# EAGLE design robot_controller (EAGLE 6.4)
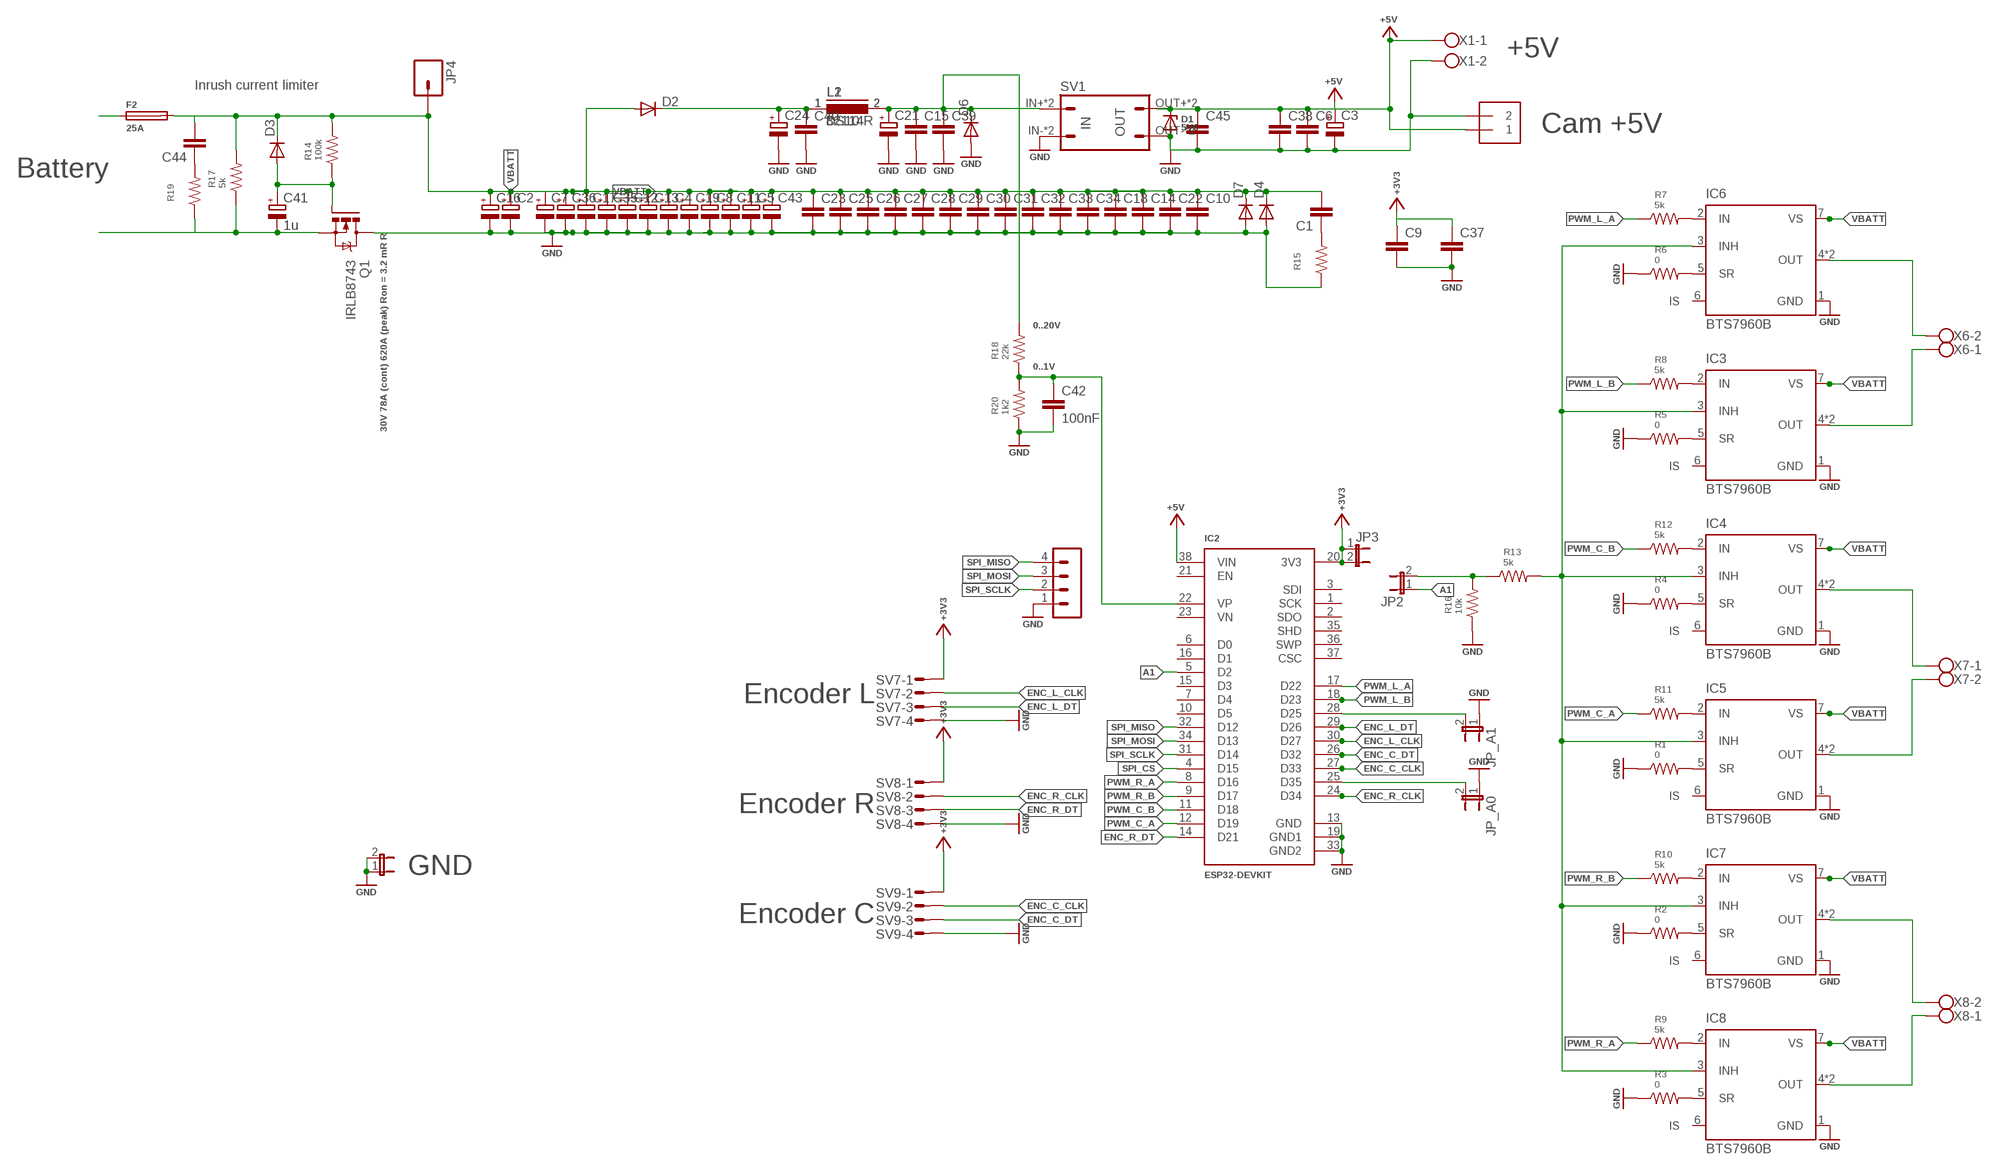
[diagram p0: schematic, sheet 1]

## Parts
C1  C-EU025-025X050  [C025-025X050]
C2  CPOL-EUE5-10.5  [E5-10,5]
C3  CPOL-EUE5-10.5  [E5-10,5]
C4  CPOL-EUE5-10.5  [E5-10,5]
C5  CPOL-EUE5-10.5  [E5-10,5]
C6  C-EUC1206  [C1206]
C7  CPOL-EUE5-10.5  [E5-10,5]
C8  CPOL-EUE5-10.5  [E5-10,5]
C9  C-EUC1206  [C1206]
C10  C-EUC1206  [C1206]
C11  CPOL-EUE5-10.5  [E5-10,5]
C12  CPOL-EUE5-10.5  [E5-10,5]
C13  CPOL-EUE5-10.5  [E5-10,5]
C14  C-EUC1206  [C1206]
C15  C-EUC1206  [C1206]
C16  CPOL-EUE5-10.5  [E5-10,5]
C17  CPOL-EUE5-10.5  [E5-10,5]
C18  C-EUC1206  [C1206]
C19  CPOL-EUE5-10.5  [E5-10,5]
C21  CPOL-EUE5-10.5  [E5-10,5]
C22  C-EUC1206  [C1206]
C23  C-EUC1206  [C1206]
C24  CPOL-EUE5-10.5  [E5-10,5]
C25  C-EUC1206  [C1206]
C26  C-EUC1206  [C1206]
C27  C-EUC1206  [C1206]
C28  C-EUC1206  [C1206]
C29  C-EUC1206  [C1206]
C30  C-EUC1206  [C1206]
C31  C-EUC1206  [C1206]
C32  C-EUC1206  [C1206]
C33  C-EUC1206  [C1206]
C34  C-EUC1206  [C1206]
C35  CPOL-EUE5-10.5  [E5-10,5]
C36  CPOL-EUE5-10.5  [E5-10,5]
C37  C-EUC1206  [C1206]
C38  C-EUC1206  [C1206]
C39  C-EUC1206  [C1206]
C40  C-EUC1206  [C1206]
C41  1u  CPOL-EUE2.5-6  [E2,5-6]
C42  100nF  C-EUC1206  [C1206]
C43  CPOL-EUE5-10.5  [E5-10,5]
C44  C-EU050-030X075  [C050-030X075]
C45  C-EUC1206  [C1206]
D1  5V6  ZENER-DIODEDO41Z10  [DO41Z10]
D2  DIODE-DO15-12  [DO15-12]
D3  DIODE-DO-214AC  [DO-214AC]
D4  DIODE-DO41-7.6  [DO41-7.6]
D6  DIODE-DO15-12  [DO15-12]
D7  DIODE-DO41-7.6  [DO41-7.6]
F2  25A  19559  [SHK20L]
IC2  ESP32-DEVKIT  ESP32-DEVKIT-V1NOHOLES  [DEVKIT-V1-NOHOLES]
IC3  BTS7960B  TLE5205-2G  [P-TO263-7-1]
IC4  BTS7960B  TLE5205-2G  [P-TO263-7-1]
IC5  BTS7960B  TLE5205-2G  [P-TO263-7-1]
IC6  BTS7960B  TLE5205-2G  [P-TO263-7-1]
IC7  BTS7960B  TLE5205-2G  [P-TO263-7-1]
IC8  BTS7960B  TLE5205-2G  [P-TO263-7-1]
J6  1X2-3.5MM  [3.5MMTERM]
JP1  JP1E  [JP1]
JP2  JP1E  [JP1]
JP3  JP1E  [JP1]
JP4  M01PTH_LONGPAD  [1X01_LONGPAD]
JP_A0  JP1E  [JP1]
JP_A1  JP1E  [JP1]
L1  82114R  [82114R]
L2  DS10  [DS10]
Q1  IRLB8743  IRF540  [TO220BV]
R1  0  R-US_R1206  [R1206]
R2  0  R-US_R1206  [R1206]
R3  0  R-US_R1206  [R1206]
R4  0  R-US_R1206  [R1206]
R5  0  R-US_R1206  [R1206]
R6  0  R-US_R1206  [R1206]
R7  5k  R-US_R1206  [R1206]
R8  5k  R-US_R1206  [R1206]
R9  5k  R-US_R1206  [R1206]
R10  5k  R-US_R1206  [R1206]
R11  5k  R-US_R1206  [R1206]
R12  5k  R-US_R1206  [R1206]
R13  5k  R-US_R1206  [R1206]
R14  100k  R-US_R1206  [R1206]
R15  R-US_0411/3V  [0411V]
R16  10k  R-US_R1206  [R1206]
R17  5k  R-US_R1206  [R1206]
R18  22k  R-US_R1206  [R1206]
R19  R-US_0617/5V  [0617V]
R20  1k2  R-US_R1206  [R1206]
SV1  MA04-1SMALL  [MA04-2]
SV6  MA04-1  [MA04-1]
SV7  MT6-4  [MT6-4]
SV8  MT6-4  [MT6-4]
SV9  MT6-4  [MT6-4]
X1  W239-302  [W239-302]
X6  W239-302  [W239-302]
X7  W239-302  [W239-302]
X8  W239-302  [W239-302]

## Nets
+3V3: C9.1 C37.1 IC2.20(3V3) JP3.1 JP3.2 SV7.1 SV8.1 SV9.1
+5V: C3.+ C6.1 C38.1 C45.1 D1.C IC2.38(VIN) J6.1 SV1.OUT+ SV1.OUT+1(OUT+) X1.1
A1: IC2.5(D2) JP2.1
ENC_C_CLK: IC2.27(D33) SV9.2
ENC_C_DT: IC2.26(D32) SV9.3
ENC_L_CLK: IC2.30(D27) SV7.2
ENC_L_DT: IC2.29(D26) SV7.3
ENC_R_CLK: IC2.24(D34) SV8.2
ENC_R_DT: IC2.14(D21) SV8.3
GND: C2.- C3.- C4.- C5.- C6.2 C7.- C8.- C9.2 C10.2 C11.- C12.- C13.- C14.2 C15.2 C16.- C17.- C18.2 C19.- C21.- C22.2 C23.2 C24.- C25.2 C26.2 C27.2 C28.2 C29.2 C30.2 C31.2 C32.2 C33.2 C34.2 C35.- C36.- C37.2 C38.2 C39.2 C40.2 C42.2 C43.- C45.2 D1.A D4.A D6.A D7.A IC2.13(GND) IC2.19(GND1) IC2.33(GND2) IC3.1(GND) IC4.1(GND) IC5.1(GND) IC6.1(GND) IC7.1(GND) IC8.1(GND) J6.2 JP1.1 JP1.2 JP_A0.1 JP_A1.1 Q1.D R1.1 R2.1 R3.1 R4.1 R5.1 R6.1 R15.1 R16.1 R20.1 SV1.IN- SV1.IN-1(IN-) SV1.OUT- SV1.OUT-1(OUT-) SV6.1 SV7.4 SV8.4 SV9.4 X1.2
N$1: C24.+ C40.1 D2.C L1.1 L2.1
N$2: IC7.4(OUT) IC7.8(OUT) X8.2
N$3: IC7.5(SR) R2.2
N$4: IC8.4(OUT) IC8.8(OUT) X8.1
N$5: IC5.4(OUT) IC5.8(OUT) X7.2
N$6: IC4.4(OUT) IC4.8(OUT) X7.1
N$7: F2.1A F2.1B
N$8: IC2.28(D25) JP_A1.2
N$9: IC3.4(OUT) IC3.8(OUT) X6.1
N$10: IC6.4(OUT) IC6.8(OUT) X6.2
N$11: IC5.5(SR) R1.2
N$13: IC8.5(SR) R3.2
N$14: IC4.5(SR) R4.2
N$15: C15.1 C21.+ C39.1 D6.C L1.2 L2.2 R18.2 SV1.IN+ SV1.IN+1(IN+)
N$16: IC3.5(SR) R5.2
N$17: IC6.5(SR) R6.2
N$18: IC3.3(INH) IC4.3(INH) IC5.3(INH) IC6.3(INH) IC7.3(INH) IC8.3(INH) R13.2
N$20: IC6.2(IN) R7.2
N$21: IC4.2(IN) R12.2
N$22: IC5.2(IN) R11.2
N$23: IC7.2(IN) R10.2
N$24: IC8.2(IN) R9.2
N$25: IC3.2(IN) R8.2
N$26: C1.1 R15.2
N$27: JP2.2 R13.1 R16.2
N$29: IC2.25(D35) JP_A0.2
N$76: C41.+ D3.A Q1.G R14.1
N$78: C41.- Q1.S R17.1 R19.1
N$79: C42.1 IC2.22(VP) R18.1 R20.2
N$80: C44.1 R19.2
PWM_C_A: IC2.12(D19) R11.1
PWM_C_B: IC2.11(D18) R12.1
PWM_L_A: IC2.17(D22) R7.1
PWM_L_B: IC2.18(D23) R8.1
PWM_R_A: IC2.8(D16) R9.1
PWM_R_B: IC2.9(D17) R10.1
SPI_CS: IC2.4(D15)
SPI_MISO: IC2.32(D12) SV6.4
SPI_MOSI: IC2.34(D13) SV6.3
SPI_SCLK: IC2.31(D14) SV6.2
VBATT: C1.2 C2.+ C4.+ C5.+ C7.+ C8.+ C10.1 C11.+ C12.+ C13.+ C14.1 C16.+ C17.+ C18.1 C19.+ C22.1 C23.1 C25.1 C26.1 C27.1 C28.1 C29.1 C30.1 C31.1 C32.1 C33.1 C34.1 C35.+ C36.+ C43.+ C44.2 D2.A D3.C D4.C D7.C F2.2A F2.2B IC3.7(VS) IC4.7(VS) IC5.7(VS) IC6.7(VS) IC7.7(VS) IC8.7(VS) JP4.1 R14.2 R17.2
Unconnected: IC2.1(SCK) IC2.2(SDO) IC2.3(SDI) IC2.6(D0) IC2.7(D4) IC2.10(D5) IC2.15(D3) IC2.16(D1) IC2.21(EN) IC2.23(VN) IC2.35(SHD) IC2.36(SWP) IC2.37(CSC) IC3.6(IS) IC4.6(IS) IC5.6(IS) IC6.6(IS) IC7.6(IS) IC8.6(IS)

## Notes on the sheet
- +5V
- Inrush current limiter
- Cam +5V
- Battery
- 0..20V
- 0..1V
- 30V 78A (cont) 620A (peak) Ron = 3.2 mR R
- Encoder L
- Encoder R
- GND
- Encoder C

## Library data of the parts
C1 C6 C9 C10 C14 C15 C18 C22 C23 C25-C34 C37-C40 C42 C44 C45 = rcl:C-EU: CAPACITOR, European symbol
C2-C5 C7 C8 C11-C13 C16 C17 C19 C21 C24 C35 C36 C41 C43 = rcl:CPOL-EU: POLARIZED CAPACITOR, European symbol
D1 = diode:ZENER-DIODE: Z-Diode
D2 D6 = diode:DIODE-: DIODE
D3 D4 D7 = diode_smd:DIODE-: DIODE
F2 = car_fuse:19559: FUSE HOLDER TR5, Wickmann
IC2 = ESP32-DEVKIT-V1:ESP32-DEVKIT-V1: Dual core, Wi-Fi: 2.4 GHz up to 150 Mbits/s,BLE (Bluetooth Low Energy) and legacy Bluetooth, 32 bits, Up to 240 MHz Check prices <https://pricing.snapeda.com/parts/ESP32-DEVKIT-V1/Do%20it/view-part?ref=eda>
IC3-IC8 = untitled:TLE5205-2: 5-A H-Bridge for DC-Motor Applications Source: http://www.infineon.com .. tle5205-2.pdf; OC_FARNELL: unknown; OC_NEWARK: unknown
J6 = adafruit:1X2: 3.5mm Terminal block http://www.ladyada.net/library/pcb/eaglelibrary.html
JP1-JP3 JP_A0 JP_A1 = jumper:JP1E: JUMPER
JP4 = SparkFun:M01: Header 1 Standard 1-pin 0.1" header. Use with straight break away headers (SKU : PRT-00116), right angle break away headers (PRT-00553), swiss pins (PRT-00743), machine pins (PRT-00117), and female headers (PRT-00115).
L1 = inductors:82114R: INDUCTOR
L2 = inductors:DS10: INDUCTOR
Q1 = transistor-power:IRF540: HEXFET Power MOSFET
R1-R20 = rcl:R-US_: RESISTOR, American symbol
SV1 = voltage_converter:MA04-1: PIN HEADER
SV6 = con-lstb:MA04-1: PIN HEADER; OC_FARNELL: unknown; OC_NEWARK: unknown
SV7-SV9 = con-amp-mt:MT6-4: AMP MT6 CONNECTOR; OC_FARNELL: unknown; OC_NEWARK: unknown
X1 X6-X8 = voltage_converter:W239-302: WAGO SCREW CLAMP; OC_FARNELL: unknown; OC_NEWARK: unknown

## Board
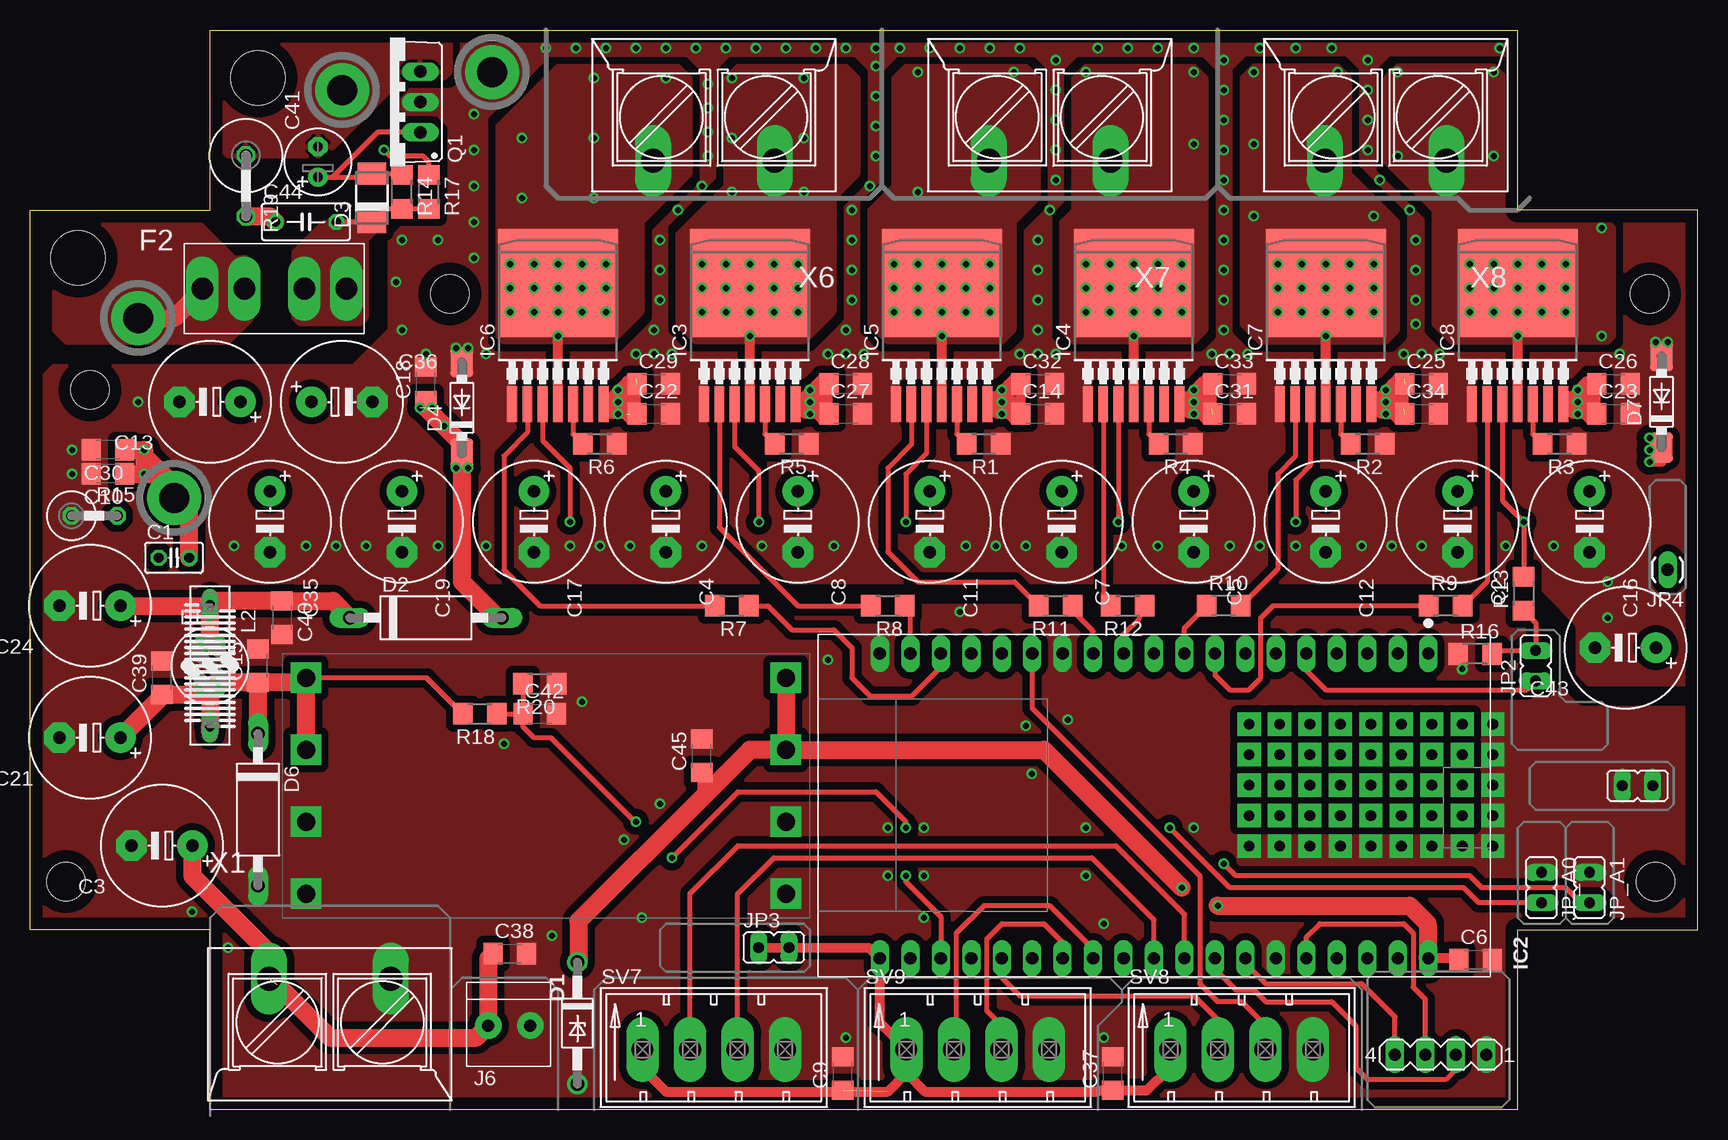
[diagram p1: board, top side]
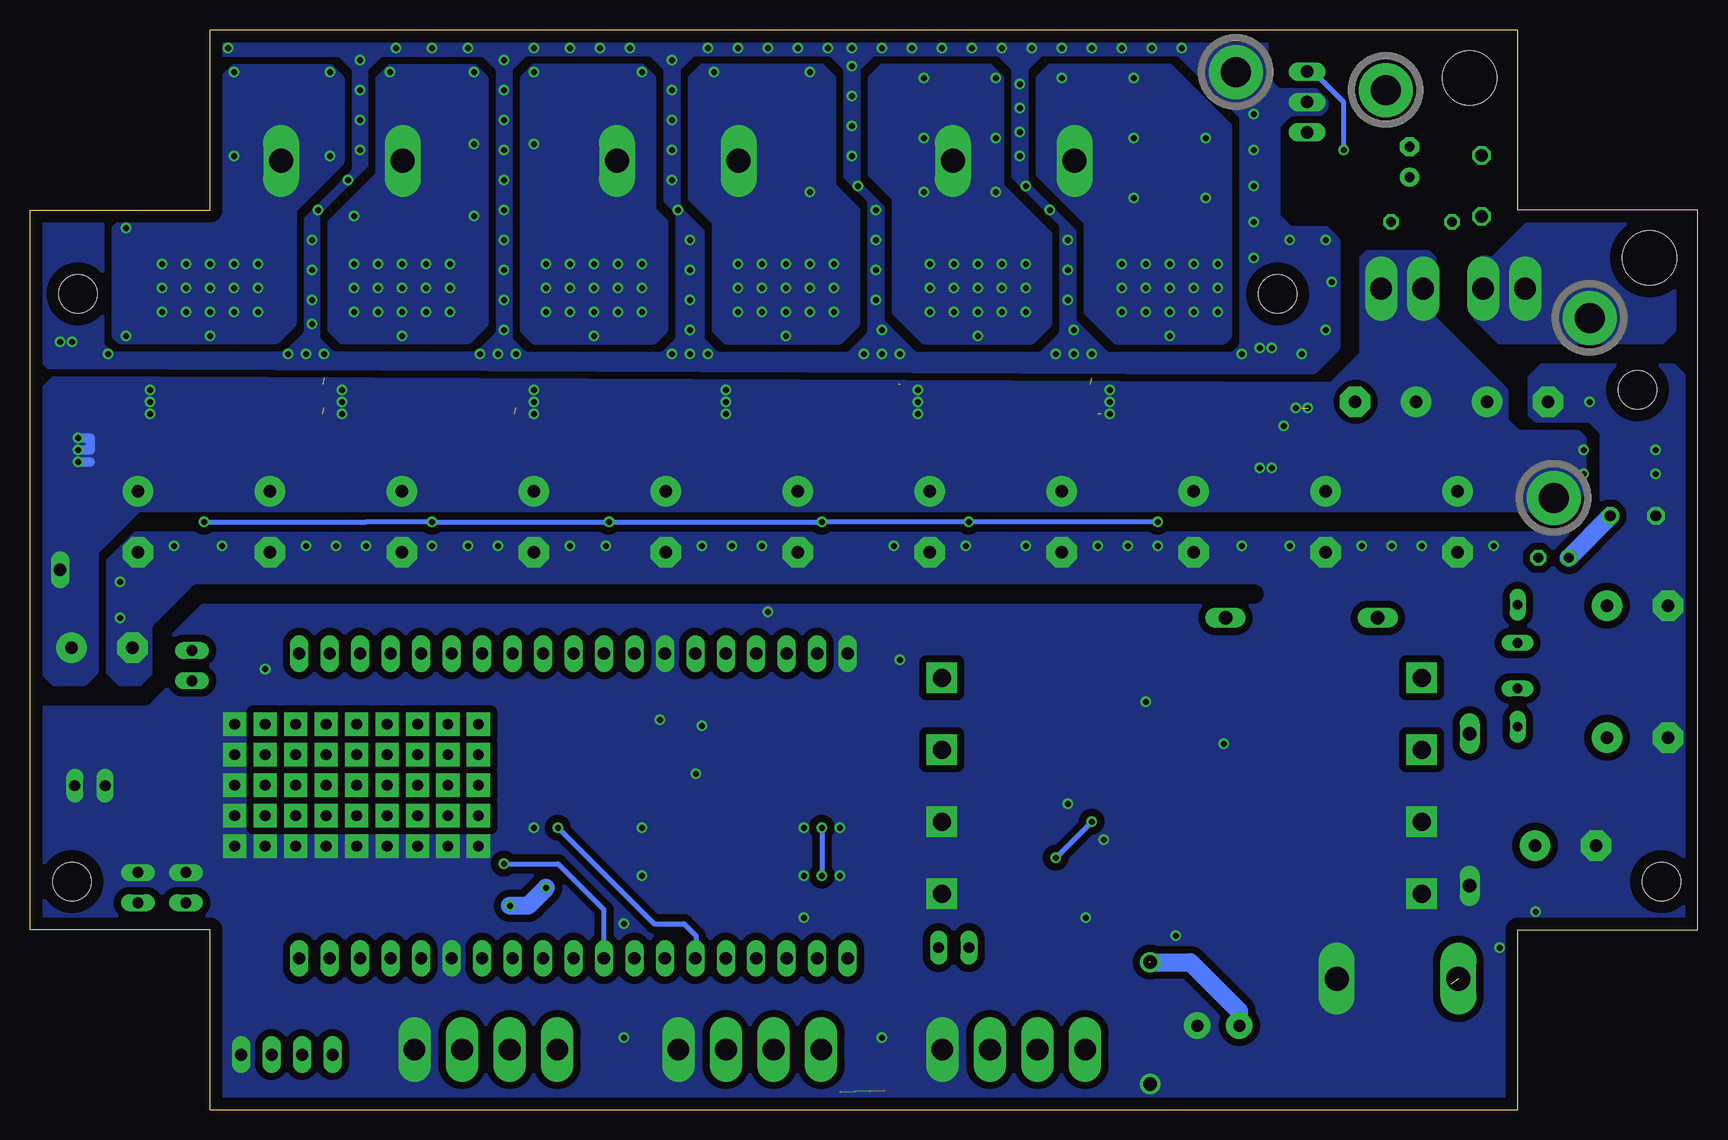
[diagram p2: board, bottom side, seen from below]

Size 139 x 90 mm. Coordinates in mm from the lower left corner, seen from the top.
Outline: 124,0 15,0 15,15 0,15 0,75 15,75 15,90 124,90 124,75 139,75 139,15 124,15 124,0
Copper layers (1*16): Top 0.035mm / dielectric 1.5mm / Bottom 0.035mm
Design rules "default *": minimum track width 10mil, minimum drill 24mil, track to track 8mil, track to pad 8mil, pad to pad 8mil, via to via 8mil, smd to smd 8mil, copper to edge 40mil, drill to drill 8mil, minimum pad ring 10mil, minimum via ring 8mil, stop-mask expansion 4mil, vias tented up to drill 0mil, thermal gap 10mil
Holes 3.2 mm at 5,60 3,19 135.5,19 135,68 35,68
Holes 4.5 mm at 4,71 19,86
tRestrict: 6 lines
bRestrict: area 26.7,57.2 to 30.3,60.8; 5 lines

### Footprints (pad centres in the part's own frame; a part is rotated, then mirrored left to right if it is on the bottom)
C025-025X050 = drill 0.813 octagon: 1 -1.27,0; 2 1.27,0
E5-10,5 = drill 1.016 pad 2.54: + -2.54,0 | drill 1.016 pad 2.54 octagon: - 2.54,0
C1206 = smd 1.6 x 1.8: 1 -1.4,0; 2 1.4,0
E2,5-6 = drill 0.813 pad 1.6: + -1.27,0 | drill 0.813 pad 1.6 octagon: - 1.27,0
C050-030X075 = drill 0.813 octagon: 1 -2.54,0; 2 2.54,0
DO41Z10 = drill 1.118: A 5.08,0; C -5.08,0
DO15-12 = drill 1.118 long: A 6.35,0; C -6.35,0
DO-214AC = smd 1.8 x 2.4: A 2.025,0; C -2.025,0
DO41-7.6 = smd 2.54 x 1.905: A 3.81,0; C -3.81,0
SHK20L = drill 1.8 pad 2.54 long: 1A 1.5,0; 1B 5,0; 2A 10,0; 2B 13.5,0
DEVKIT-V1-NOHOLES = drill 1.016 pad 1.422 long: 1 12.7,-19.05; 2 12.7,-16.51; 3 12.7,-13.97; 4 12.7,-11.43; 5 12.7,-8.89; 6 12.7,-6.35; 7 12.7,-3.81; 8 12.7,-1.27; 9 12.7,1.27; 10 12.7,3.81; 11 12.7,6.35; 12 12.7,8.89; 13 12.7,11.43; 14 12.7,13.97; 15 12.7,16.51; 16 12.7,19.05; 17 12.7,21.59; 18 12.7,24.13; 19 12.7,26.67; 20 -12.7,26.67; 21 -12.7,24.13; 22 -12.7,21.59; 23 -12.7,19.05; 24 -12.7,16.51; 25 -12.7,13.97; 26 -12.7,11.43; 27 -12.7,8.89; 28 -12.7,6.35; 29 -12.7,3.81; 30 -12.7,1.27; 31 -12.7,-1.27; 32 -12.7,-3.81; 33 -12.7,-6.35; 34 -12.7,-8.89; 35 -12.7,-11.43; 36 -12.7,-13.97; 37 -12.7,-16.51; 38 -12.7,-19.05
P-TO263-7-1 = smd 0.8 x 3: 1 -3.81,-9.207; 2 -2.54,-9.207; 3 -1.27,-9.207; 4 0,-9.207; 5 1.27,-9.207; 6 2.54,-9.207; 7 3.81,-9.207 | smd 10 x 9: 8 0,0.895
3.5MMTERM = drill 1 pad 2.184: 1 1.8,0; 2 -1.7,0
JP1 = drill 0.914 long: 1 0,-1.27; 2 0,1.27
1X01_LONGPAD = drill 1.016 long: 1 0,0
82114R = drill 0.813 long: 1 0,1.905; 2 0,-1.905
DS10 = drill 0.813 long: 1 -5.08,0; 2 5.08,0
TO220BV = drill 1.016 long: D 0,-2.54; G -2.54,-2.54; S 2.54,-2.54
R1206 = smd 1.6 x 1.803: 1 -1.422,0; 2 1.422,0
0411V = drill 0.914 octagon: 1 -2.54,0; 2 1.27,0
0617V = drill 1.016 octagon: 1 -2.54,0; 2 2.54,0
MA04-2 = drill 1.5 pad 2.54 square: IN+ -3,-20; IN+1 -9,-20; IN- 3,-20; IN-1 9,-20; OUT+ -3,20; OUT+1 -9,20; OUT- 3,20; OUT-1 9,20
MA04-1 = drill 1.016 long: 1 -3.81,0; 2 -1.27,0; 3 1.27,0; 4 3.81,0
MT6-4 = drill 1.803 long: 1 -5.944,0; 2 -1.981,0; 3 1.981,0; 4 5.944,0
W239-302 = drill 2 long: 1 -5.08,1.905; 2 5.08,1.905

### Placement (x,y rotation side)
C1  12,46 0 top
C2  119,49 270 top
C3  11,22 180 top
C4  53,49 270 top
C5  97,49 270 top
C6  120.5,12.5 0 top
C7  86,49 270 top
C8  64,49 270 top
C9  67.75,3 90 top
C10  6.5,53 180 top
C11  75,49 270 top
C12  108,49 270 top
C13  15,59 180 top
C14  84,58 0 top
C15  19,37 90 top
C16  130,49 270 top
C17  42,49 270 top
C18  33,60.5 90 top
C19  31,49 270 top
C21  5,31 180 top
C22  52,58 0 top
C23  132,58 0 top
C24  5,42 180 top
C25  116,60.5 0 top
C26  132,60.5 0 top
C27  68,58 0 top
C28  68,60.5 0 top
C29  52,60.5 0 top
C30  6.5,55 180 top
C31  100,58 0 top
C32  84,60.5 0 top
C33  100,60.5 0 top
C34  116,58 0 top
C35  20,49 270 top
C36  26,59 0 top
C37  90.25,3 90 top
C38  40,13 0 top
C39  11,36 90 top
C40  21,41 270 top
C41  24,79 90 top
C42  42.5,33 0 top
C43  133,38.5 180 top
C44  23,74 0 top
C45  56,29.5 90 top
D1  45.62,7.2 270 top
D2  33,41 0 top
D3  28.5,76 90 top
D4  36,58.5 90 top
D6  19,25 270 top
D7  136,59 90 top
F2  12.87,68.44 0 top
IC2  97.51,25.31 90 top
IC3  60,68 0 top
IC4  92,68 0 top
IC5  76,68 0 top
IC6  44,68 0 top
IC7  108,68 0 top
IC8  124,68 0 top
J6  40,7 180 top
JP1  134,27 90 top
JP2  125.5,37 0 top
JP3  62,13.5 270 top
JP4  136.5,45 180 top
JP_A0  126,18.5 180 top
JP_A1  130,18.5 180 top
L1  15,37 0 top
L2  15,37 270 top
Q1  30,84 90 top
R1  79.5,55.5 180 top
R2  111.5,55.5 180 top
R3  127.5,55.5 180 top
R4  95.5,55.5 180 top
R5  63.5,55.5 180 top
R6  47.5,55.5 180 top
R7  58.5,42 180 top
R8  71.5,42 180 top
R9  118,42 0 top
R10  99.5,42 0 top
R11  85.5,42 180 top
R12  91.5,42 180 top
R13  124.5,43 90 top
R14  31,76.5 270 top
R15  6,49.5 0 top
R16  120.46,37.98 0 top
R17  33.25,76.5 270 top
R18  37.5,33 180 top
R19  18,77 270 top
R20  42.5,35.5 180 top
SV1  43,27 270 top
SV6  117.59,4.58 180 top
SV7  57,5 0 top
SV8  101,5 0 top
SV9  79,5 0 top
X1  25,9 0 top
X6  57,81 180 top
X7  85,81 180 top
X8  113,81 180 top

### Tracks (layer width: path | path; a pad name or v marks a point on that pad's centre or on a via)
+3V3  (1 unrouted)
  Top 0.8: JP3.1 JP3.2 69.95,13.5 IC2.20
  Top 0.813: IC2.20 70.84,7.22 SV9.1 73.06,3.06 | SV7.1 51,4.94 51,3.5 53,1.5 71.5,1.5 73.06,3.06 | 73.06,3.06 74.61,1.5 89,1.5 89.1,1.6 C37.1 93.1,1.6 95,3.5 95,4.94 SV8.1
+5V  (via drill 0.5 pad 0.41)  (2 unrouted)
  Top 0.813: C6.1 118.99,12.61 IC2.38 | C45.1 56,26.5 56.25,26.25
  Top 1.5: C3.+ 13.54,19.46 19.92,13.08 X1.1 | 20.56,10.44 25,6 37.2,6 J6.1 38.2,12.6 C38.1 | SV1.OUT+1 SV1.OUT+ | SV1.OUT+ 60,30 56.25,26.25 45.72,15.72 45.72,12.28 | SV1.OUT+ 84.5,30 v96,18.5 | v99,17 115,17 116.5,15.5 116.5,12.67 IC2.38
  Bottom 1.5: J6.1 38.2,8.2 42.28,12.28 D1.C | v96,18.5 97.5,17 v99,17
A1
  Top 0.406: IC2.5 106.4,36.6 108,35 124.77,35 JP2.1
ENC_C_CLK
  Top 0.406: IC2.27 88.62,13.38 85,17 79.5,17 77.2,14.7 77.2,7.18 77.02,7 SV9.2
ENC_C_DT
  Top 0.406: SV9.3 80.98,7.02 79.75,8.25 79.75,14.25 81,15.5 84.5,15.5 86.08,13.92 IC2.26
ENC_L_CLK
  Top 0.406: SV7.2 55.02,18.02 59,22 90.5,22 96.24,16.26 IC2.30
ENC_L_DT
  Top 0.406: SV7.3 58.98,17.98 62,21 88.5,21 93.7,15.8 IC2.29
ENC_R_CLK
  Top 0.406: IC2.24 81,11 82.5,9.5 97,9.5 99,7.5 99,5.02 SV8.2
ENC_R_DT
  Top 0.406: 102.98,6 102.98,7.02 101,9 99,9 97.5,10.5 97.5,19.5 83.54,33.46 IC2.14
  Top 0.61: SV8.3 102.98,6 103,6.02
GND  (via drill 0.5, 0.5 pad 0.41, 0.9 pad 1.93, 2.5 pad 4.5)
  other vias: 52,65 38,63 52,63 45,47 50,47 56,47 68,63 66.5,63 50.5,63 61,47 67,47 83,47 91,47 94,47 100,47 105.5,47 111,47 116,47 28,47 23,47 3.5,55 9,59 36.5,63.5 84,63 85.5,63 123,47 127,47 131.5,44 38,47 34,47 54,75 56,77 37,80 34,72.5 37,71 102.5,47 113.5,47 77.5,41.5 131.5,41 80.5,47 78,47 47.5,47 25.5,47 17,47 69.5,63 82.5,63 53.5,63 114.5,63 116,63 117.5,63 132.5,63 100,63 98.5,63 101.5,63 68,65 68.5,67.5 68.5,70 68.5,72.5 68.5,75 70,77 70.5,79.5 52.5,67.5 52.5,70 52.5,72.5 84,65 99.5,65 115.5,65.5 37,74 31,72.5 30.5,69 37,77 37,83 35.5,63.5 31,65 33,63 84,67.5 84,70 84,72.5 85,75 85.5,77.5 85.5,80 85.5,82.5 85.5,85 85.5,87.5 70.5,82 70.5,84.5 70.5,87 99.5,67.5 99.5,70 99.5,72.5 99.5,75 99.5,77.5 99.5,80 99.5,82.5 99.5,85 99.5,87.5 115.5,67.5 115.5,70 115.5,72.5 115,75 112.5,77.5 111.5,80 111.5,82.5 111.5,85 111.5,87.5 122.5,88.5 108.5,88.5 105.5,88.5 102.5,88.5 97,88.5 94,88.5 91.5,88.5 89,88.5 82.5,88.5 80,88.5 77.5,88.5 75,88.5 72.5,88.5 70.5,88.5 68,88.5 65.5,88.5 136.5,64 56.5,79.5 56.5,81.5 56.5,83.5 56.5,85.5 63,88.5 60.5,88.5 58,88.5 55.5,88.5 53,88.5 50.5,88.5 48,88.5 45.5,88.5 43,88.5 121.94,21.96 121.94,24.5 121.94,27.04 121.94,29.58 121.94,32.12 97,23.5 88,23.5 89.5,15.5 74.5,16 74.5,23.5 66.5,37.5 135.5,64 71.5,23.5 71.5,19.5 74.5,19.5 119.4,36.71 46,34 39.5,30.5 49.5,22.5 43.5,14.5 52.5,25.5 51,16 68,6 89.5,6 83.5,28 83,32 86.5,32.5 88,19.5 16.5,13.5 13.5,16.5 101.62,21.96 104.16,21.96 106.7,21.96 109.24,21.96 111.78,21.96 114.32,21.96 116.86,21.96 119.4,21.96 38.5,86.5 3.5,53
  pour Top (isolate 0.6, rank 4, no thermals): 37,90 139,90 139,0 0,0 1,61 2,62 27,62 30,65 30,72.5 31,73.5 34,73.5 35,74.5 35,82 34,83 31.5,83 31,83.5 31,84.5 31.5,85 35,85 36,86 36,89
  pour Bottom (isolate 0.61, rank 2, no thermals): 1,61 2,62 13,62 14,61 14,58 13.5,57.5 9,57.5 8,56.5 8,50.5 10.5,48 130.5,48 133,45.5 133,37 130.5,34.5 138,34.5 138,0 0,0
  pour Bottom (isolate 0.6, rank 5, no thermals): 30,63.5 32,61.5 137,61.5 138,62.5 138,90.5 37,90 36,89 36,86 35,85 31.5,85 31,84.5 31,83.5 31.5,83 34,83 35,82 35,74.5 34,73.5 31,73.5 30,72.5
N$1
  Top 1.5: L1.1 L2.1 | C24.+ 14.92,42 L2.1 | L2.1 15.32,42.4 C40.1 25.25,42.4 D2.C
N$2  (via drill 0.5 pad 0.9)
  Top 0.813: IC7.4 IC7.8
  other vias: 102,74.5 109,86.5 102,86.5 102,80.5 112,74.5 108,68.5 110,68.5 112,68.5 112,66.5 110,66.5 108,66.5 108,64.5 106,66.5 104,66.5 104,68.5 106,68.5 104,70.5 106,70.5 108,70.5 110,70.5 112,70.5
  pour Top (isolate 0.5, rank 3, no thermals): 101,65.5 102.5,64 113,64 114,65 114,74 110,78 110,86 109,87 102,87 101,86
  pour Bottom (isolate 0.5, rank 3, no thermals): 101,65.5 102.5,64 113,64 114,65 114,74 110,78 110,86 109,87 102,87 101,86
N$3
  Top 0.406: IC7.5 109.27,56.31 R2.2
N$4  (via drill 0.5 pad 0.9)
  Top 0.813: IC8.4 IC8.8
  other vias: 122,79.5 122,86.5 114,86.5 114,79.5 124,68.5 122,68.5 120,68.5 120,66.5 122,66.5 124,66.5 124,64.5 126,66.5 128,66.5 128,68.5 126,68.5 126,70.5 128,70.5 124,70.5 122,70.5 120,70.5 131,64.5 131,73.5
  pour Top (isolate 0.5, rank 3, no thermals): 131.5,64 132,64.5 132,73.5 130.5,75 124,75 123,76 123,86 122,87 114,87 113,86 113,79 117,75 117,65.5 118.5,64
  pour Bottom (isolate 0.5, rank 3, no thermals): 131.5,64 132,64.5 132,73.5 130.5,75 124,75 123,76 123,86 122,87 114,87 113,86 113,79 117,75 117,65.5 118.5,64
N$5  (via drill 0.5 pad 0.9)
  Top 0.813: IC5.4 IC5.8
  other vias: 78,68.5 74,68.5 72,68.5 80,68.5 72,70.5 76,68.5 74,70.5 76,70.5 78,70.5 80,70.5 80,66.5 78,66.5 76,66.5 74,66.5 72,66.5 76,64.5 74,76.5 74,86.5 82,86.5
  pour Top (isolate 0.5, no thermals): 81,64 71.5,64 70,65.5 70,75 72,77 72,86 73,87 83,87 84,86 84,76 82,74 82,65
  pour Bottom (isolate 0.5, rank 3, no thermals): 81,64 71.5,64 70,65.5 70,75 72,77 72,86 73,87 83,87 84,86 84,76 82,74 82,65
N$6  (via drill 0.5 pad 0.9)
  Top 0.813: IC4.4 IC4.8
  other vias: 92,70.5 90,70.5 88,70.5 94,70.5 96,70.5 92,68.5 88,86.5 97,86.5 97,80.5 88,68.5 90,68.5 94,68.5 96,68.5 96,66.5 94,66.5 92,66.5 90,66.5 88,66.5 92,64.5
  pour Top (isolate 0.5, rank 3, no thermals): 87,64 86,65 86,74 87,75 87,86 88,87 97,87 98,86 98,65 97,64
  pour Bottom (isolate 0.5, rank 3, no thermals): 87,64 86,65 86,74 87,75 87,86 88,87 97,87 98,86 98,65 97,64
N$7  (via drill 2.5 pad 4.5)
  Top 1.5: v9,66 12,66 14.5,68.5
  pour Bottom (no thermals): 3,64 16.5,64 18.5,66 18.5,70.5 18,71 17,71 14,74 3,74 2,73 2,65
  pour Top (no thermals): 3,64 16.5,64 18.5,66 18.5,70.5 18,71 17,71 14,74 3,74 2,73 2,65
N$8  (via drill 0.5)
  Top 0.406: JP_A1.2 129.27,17.23 128,18.5 121,18.5 120,19.5 100.5,19.5 v99.5,20.5
  Bottom 0.406: v99.5,20.5 95,20.5 91.16,16.66 IC2.28
N$9  (via drill 0.5 pad 0.9)
  Top 0.813: IC3.4 IC3.8
  other vias: 58.5,86 58.5,81 58.5,76.5 60,68.5 58,68.5 56,68.5 62,68.5 64,68.5 64,66.5 62,66.5 60,66.5 58,66.5 56,66.5 56,70.5 58,70.5 60,70.5 62,70.5 64,70.5 60,64.5 64.5,76.5 64.5,81 64.5,86
  pour Top (no thermals): 54,65.5 54,73 58,77 58,86 59,87 68,87 69,86 69,78 67,76 67,66.5 64.5,64 55.5,64
  pour Bottom (isolate 0.5, rank 4, no thermals): 54,65.5 54,73 58,77 58,86 59,87 68,87 69,86 69,78 67,76 67,66.5 64.5,64 55.5,64
N$10  (via drill 0.5 pad 0.9)
  Top 0.813: IC6.4 IC6.8
  other vias: 41,76 53,86 47,81 41,81 47,86 44,68.5 44,70.5 46,70.5 46,68.5 48,70.5 48,68.5 42,70.5 42,68.5 40,68.5 40,70.5 40,66.5 42,66.5 44,66.5 46,66.5 48,66.5 47,76 44,64.5
  pour Top (isolate 0.5, rank 3, no thermals): 39,64.5 39,82 44,87 54,87 55,86 55,78 51,74 51,66.5 48.5,64 39.5,64
  pour Bottom (isolate 0.5, rank 3, no thermals): 39,64.5 39,82 44,87 54,87 55,86 55,78 51,74 51,66.5 48.5,64 39.5,64
N$11
  Top 0.406: IC5.5 77.27,56.31 R1.2
N$13
  Top 0.406: IC8.5 125.27,56.31 R3.2
N$14
  Top 0.406: IC4.5 93.27,56.31 R4.2
N$15
  Top 0.406: R18.2 33.08,36 SV1.IN+1
  Top 1.5: SV1.IN+ SV1.IN+1 22.6,35.6 C15.1 | D6.C C15.1 | C21.+ 11,34.46 C39.1 14.5,34.6 L1.2 | L1.2 L2.2 | C15.1 15.5,35.6 L1.2
N$16
  Top 0.406: IC3.5 61.27,56.31 R5.2
N$17
  Top 0.406: IC6.5 45.27,56.31 R6.2
N$18  (via drill 0.5, 0.5 pad 0.41, 0.5 pad 0.9)
  Top 0.406: IC6.3 42.73,55.77 45,53.5 v45,49 | IC5.3 74.73,54.73 73,53 v73,49 | IC3.3 58.73,55.27 60.75,53.25 v60.75,49 | IC4.3 v90.73,49 | R13.2 v124.5,49 122.73,50.77 IC8.3 | IC7.3 106.73,53.73 105.5,52.5 v105.5,49
  Bottom 0.406: v45,49 v60.75,49 v73,49 | v90.73,49 v73,49 | v124.5,49 111,49 v105.5,49 v73,49
  Bottom 0.61: v90.73,49 arc90 90.71,49.02
N$20
  Top 0.406: IC6.2 41.46,56.46 39.5,54.5 39.5,45 42.5,42 R7.2
N$21
  Top 0.406: IC4.2 89.46,43.04 90,42.5 90,42.08
  Top 0.61: 90,42.08 R12.2
N$22
  Top 0.406: IC5.2 73.46,55.46 71.5,53.5 71.5,46.5 74,44 82.08,44 R11.2
N$23
  Top 0.406: IC7.2 105.46,54.46 104,53 104,45.08 R10.2
N$24
  Top 0.406: IC8.2 121.46,44.04 R9.2
N$25
  Top 0.406: IC3.2 57.46,48.54 64,42 R8.2
N$26
  Bottom 1.5: R15.2 7.27,49.46 C1.1
N$27
  Top 0.406: R16.2 122.17,38.27 JP2.2 125.5,40.58 R13.1
N$29  (via drill 0.5)
  Top 0.406: JP_A0.2 120.77,17.23 119.5,18.5 100,18.5 v95,23.5
  Bottom 0.406: v95,23.5 87,15.5 84.5,15.5 83.5,14.5 83.5,12.65 IC2.25
N$33  (via drill 0.9 pad 1.93)
  other vias: 111.78,24.5
N$34  (via drill 0.9 pad 1.93)
  other vias: 106.7,24.5
N$35  (via drill 0.9 pad 1.93)
  other vias: 109.24,24.5
N$37  (via drill 0.9 pad 1.93)
  other vias: 104.16,24.5
N$38  (via drill 0.9 pad 1.93)
  other vias: 101.62,24.5
N$41  (via drill 0.9 pad 1.93)
  other vias: 101.62,27.04
N$42  (via drill 0.9 pad 1.93)
  other vias: 104.16,27.04
N$44  (via drill 0.9 pad 1.93)
  other vias: 106.7,27.04
N$45  (via drill 0.9 pad 1.93)
  other vias: 109.24,27.04
N$46  (via drill 0.9 pad 1.93)
  other vias: 111.78,27.04
N$47  (via drill 0.9 pad 1.93)
  other vias: 111.78,29.58
N$48  (via drill 0.9 pad 1.93)
  other vias: 109.24,29.58
N$49  (via drill 0.9 pad 1.93)
  other vias: 106.7,29.58
N$51  (via drill 0.9 pad 1.93)
  other vias: 104.16,29.58
N$52  (via drill 0.9 pad 1.93)
  other vias: 101.62,29.58
N$55  (via drill 0.9 pad 1.93)
  other vias: 101.62,32.12
N$56  (via drill 0.9 pad 1.93)
  other vias: 104.16,32.12
N$58  (via drill 0.9 pad 1.93)
  other vias: 106.7,32.12
N$59  (via drill 0.9 pad 1.93)
  other vias: 109.24,32.12
N$60  (via drill 0.9 pad 1.93)
  other vias: 111.78,32.12
N$61  (via drill 0.9 pad 1.93)
  other vias: 114.32,32.12
N$62  (via drill 0.9 pad 1.93)
  other vias: 116.86,32.12
N$63  (via drill 0.9 pad 1.93)
  other vias: 119.4,32.12
N$64  (via drill 0.9 pad 1.93)
  other vias: 119.4,29.58
N$65  (via drill 0.9 pad 1.93)
  other vias: 116.86,29.58
N$66  (via drill 0.9 pad 1.93)
  other vias: 114.32,29.58
N$67  (via drill 0.9 pad 1.93)
  other vias: 114.32,27.04
N$68  (via drill 0.9 pad 1.93)
  other vias: 116.86,27.04
N$69  (via drill 0.9 pad 1.93)
  other vias: 119.4,27.04
N$70  (via drill 0.9 pad 1.93)
  other vias: 119.4,24.5
N$71  (via drill 0.9 pad 1.93)
  other vias: 116.86,24.5
N$72  (via drill 0.9 pad 1.93)
  other vias: 114.32,24.5
N$76
  Top 0.406: Q1.G 28.96,81.46 25.23,77.73 | C41.+ 25.23,77.73 | 25.23,77.73 28.21,77.73 D3.A 30.9,78.03 R14.1
N$78  (via drill 0.5, 2.5 pad 4.5)
  Top 0.406: R17.1 33.25,79 32.75,79.5 30,79.5 v29.5,80
  Bottom 0.406: v29.5,80 29.5,84 32,86.5 32.5,86.5 Q1.S
  other vias: 26,85
  pour Top: 15.5,89.5 34.5,89.5 35,89 35,86.5 34.5,86 31,86 24.5,79.5 16.5,79.5 15.5,80.5
N$79  (via drill 0.5, 0.5 pad 0.41)
  Top 0.406: R18.1 C42.1 | v50.5,24 50.42,24 43.42,31 42,31 41.1,31.9 C42.1 | v53.5,21 59,26.5 70.5,26.5 73,24 v73,23.5 | v73,19.5 73,19 75.92,16.08 IC2.22 | R20.2 41.1,35.48 C42.1
  Bottom 0.406: v50.5,24 v53.5,21 | v73,23.5 v73,19.5
N$80
  Top 1.5: R19.2 20,74.46 C44.1
PWM_C_A
  Top 0.406: IC2.12 88.62,39.88 87,41.5 | 87,41.92 R11.1
  Top 0.61: 87,41.5 87,41.92
PWM_C_B
  Top 0.406: IC2.11 91.16,39.66 92.5,41 92.5,41.58
  Top 0.61: 92.5,41.58 R12.1
PWM_L_A
  Top 0.406: R7.1 61.5,42 63.5,40 67,40 68.5,38.5 68.5,36 70,34.5 73.5,34.5 76,37 76,37.93 IC2.17
PWM_L_B
  Top 0.406: IC2.18 73.38,41.54 R8.1
PWM_R_A
  Top 0.406: R9.1 103.6,42 102.6,41 102.6,36 101.6,35 100,35 98.78,36.22 IC2.8
PWM_R_B
  Top 0.406: IC2.9 96.24,40.16 R10.1
SPI_MISO
  Top 0.406: IC2.32 101.32,12.18 103,10.5 111,10.5 113.78,7.72 SV6.4
SPI_MOSI
  Top 0.406: IC2.34 106.4,14.4 107.5,15.5 114.5,15.5 115.3,14.7 115.3,10.2 116.32,9.18 SV6.3
SPI_SCLK
  Top 0.406: SV6.2 118.86,3.36 118,2.5 111.5,2.5 110.5,3.5 110.5,7 108.5,9 103,9 102,10 100.5,10 98.78,11.72 IC2.31
VBATT  (via drill 0.5, 0.5 pad 0.9, 2.5 pad 4.5)  (7 unrouted)
  Top 0.406: R17.2 R14.2 29.6,75.08 D3.C 25.56,73.97 C44.2
  Top 0.8: 49.75,60.73 IC6.7 | v49,58 48.5,58.5 v49,59 | v49,59 v49,58 | v49,59 v49,60 | v49,58 48,58 | C27.1 66.5,58 | 66.5,58 66.23,58 | 66.23,58 66.23,60.5 | 66.23,60.5 65.5,60.5 v65,60 | v65,58 64.6,58 IC3.7 | v65,59 64,59 v65,60 | v65,59 64.5,58.5 | v65,58 v65,59 | v65,59 v65,60 | C14.1 82.6,60.4 82.5,60.5 81.5,60.5 v81,60 | v81,60 v81,59 | v81,59 v81,58 | v81,58 80.6,58 IC5.7 | v81,59 80.5,58.5 | v81,59 80.5,59 80,59.5 80.5,59.5 v81,60 | C33.1 98.5,60.5 | 98.5,61 98,61 97.5,60.5 97.73,60.5 97.73,60.73 v97,60 | v97,60 v97,59 | v97,59 v97,58 | v97,58 96.6,58 IC4.7 | v97,59 96.5,58.5 96.5,59.5 | v97,60 96.5,59.5 | 96.5,59.5 96,59.5 | v113,59 v113,60 112.5,59.5 112,59.5 | v113,59 v113,58 | v113,58 112.6,58 IC7.7 | C26.1 130.5,60.5 | 130.5,60.5 130.27,60.73 129.73,60.73 v129,60 | v129,60 v129,59 | v129,58 128.6,58 IC8.7 | v113,59 112,59 | v113,58 112.5,58.5 | v129,59 128,59 | v129,60 128.5,59.5 128,59.5 | v129,58 128.5,58.5 | C32.1 82.6,58.6 82,58 | 82,58 v81,58 | v81,59 82,58 | v81,59 82,59 v81,60 | v81,59 82,60 | C23.1 130.6,58.6 | 130.6,58.6 130,58 v129,58 | 130.6,58.6 129.6,58.6 v129,58 | v129,58 v129,59 | 130,59 v129,59 | v129,59 130,60 v129,60 | D7.C 135.81,55.19 v135,56 | v135,55 136,55 136,54 v135,54 | v65,58 66,58 | 66,58 66.23,58 | v65,59 66,58 | v65,58 66,59 | v65,59 66,59 | 66,59 v65,60 | 66.23,60.5 66.5,60.5 | 66.5,60.5 66.5,60 | 66.5,60 66.5,58 | 66.5,60 v65,60 | v49,58 50,58 | 50,58 50,59 | 50,59 v49,59 | v49,59 50,58 | v49,58 50,59 | 50,59 v49,60 | v49,59 50,60 | 50,60 v49,60 | v49,60 50,61 50.5,61 50.5,60 | 50.5,60 50.5,59 50,59 | 50,59 50,60 | 50,60 50.5,60 | v129,59 130.5,59 130.5,60.5 | 130.5,60.5 130,60.5 130,59.5 | v129,58 129.5,58 130,57.5 130.5,57.5 | v113,58 113.5,58 114,57.5 114.5,57.5 | v97,58 97.5,58 98,57.5 98.5,57.5
  Top 0.8: v81,58 81.5,58 82,57.5 82.5,57.5 | v81,60 82,61 82.5,61 82.5,59.5 | v65,60 66,61 66.5,61 66.5,60.5 | v65,58 65.5,58 66,57.5 66.5,57.5 | v49,58 49.5,58 50,57.5 50.5,57.5
  Top 0.813: IC6.7 47.81,58.19 | C22.1 49.75,58 49.75,60.73 | v97,58 98,58 98.5,58.5 98.5,60.5 | 98.5,61 98.5,60.5 | 98.5,60.5 98,60 98,58.5 97.5,58.5 97.5,60 | v113,58 114,58 114.5,58.5 114.5,61 114,61 113.5,60.5 | 113.5,60.5 v113,60 113.5,60 | 113.5,60 114,60 113.5,60.5 | 113.5,60 113.5,59.5 114,59 113.5,58.5
  Top 1.5: D2.A 39,41 36,44 D4.C 36,55.5 33,58.5 C18.1 | 19.96,51.5 C35.+ | C1.2 13.27,49.73 v12,51 12,52 11,53 | C30.1 v9.5,55 9.5,54.5 | C10.1 v9.5,53 | v9.5,53 11,53 | 9.5,54.5 v9.5,53 | 11,53 9.5,54.5
  Bottom 0.8: v135,56 134,56 134,55 v135,55 | v135,54 134,54
  Bottom 1.5: 19.54,51.54 C35.+
  other vias: 36.5,53.5 34.5,57 35.5,53.5 32.5,58.5 33.5,58.5
  pour Bottom (no thermals): 9.5,51.5 11,50 130,50 133.5,46.5 133.5,36.5 134.5,35.5 137,35.5 138,36.5 138,60 137,61 30.5,60.5 28,63 28,71 27.5,71.5 22.5,71.5 22,71 22,66 16,60 16,57.5 15,56.5 10,56.5 9.5,56
  pour Top (no thermals): 22,71.5 24.5,74 28.5,74 29,73.5 28,72.5 28,66 27.5,65.5 22.5,65.5 22,66

### Text on the board
Reference: 15 | 60 | 15 | 15 | 15 | 109 | All dimensions in mm
tDocu: BAT | - | + | + | + | ML | - | MC | - | MR | GND | - | BAT | + | F=30A | +12V | +12V | ENABLE | MOTORS | GND | A0 | A1 | -- | ++ | 5V | 3V3 | L | C | 3V3 | CK | DT | GND | R | MISO | MOSI | CLK | GND | + | 5V | - | SPI
bDocu: - | BAT | GND | BAT | + | +12V | Robot controller / v1.3 - Jul 2023 | ENCL | 3V3 | CK | DT | GND | ENCC | ENCR